# EasyEDA schematic TD-01 Mk3.json
TITLE: Sheet_1; REV: 1.0; Date: 2020-10-02; Sheet: 1/1; Company: Your Company
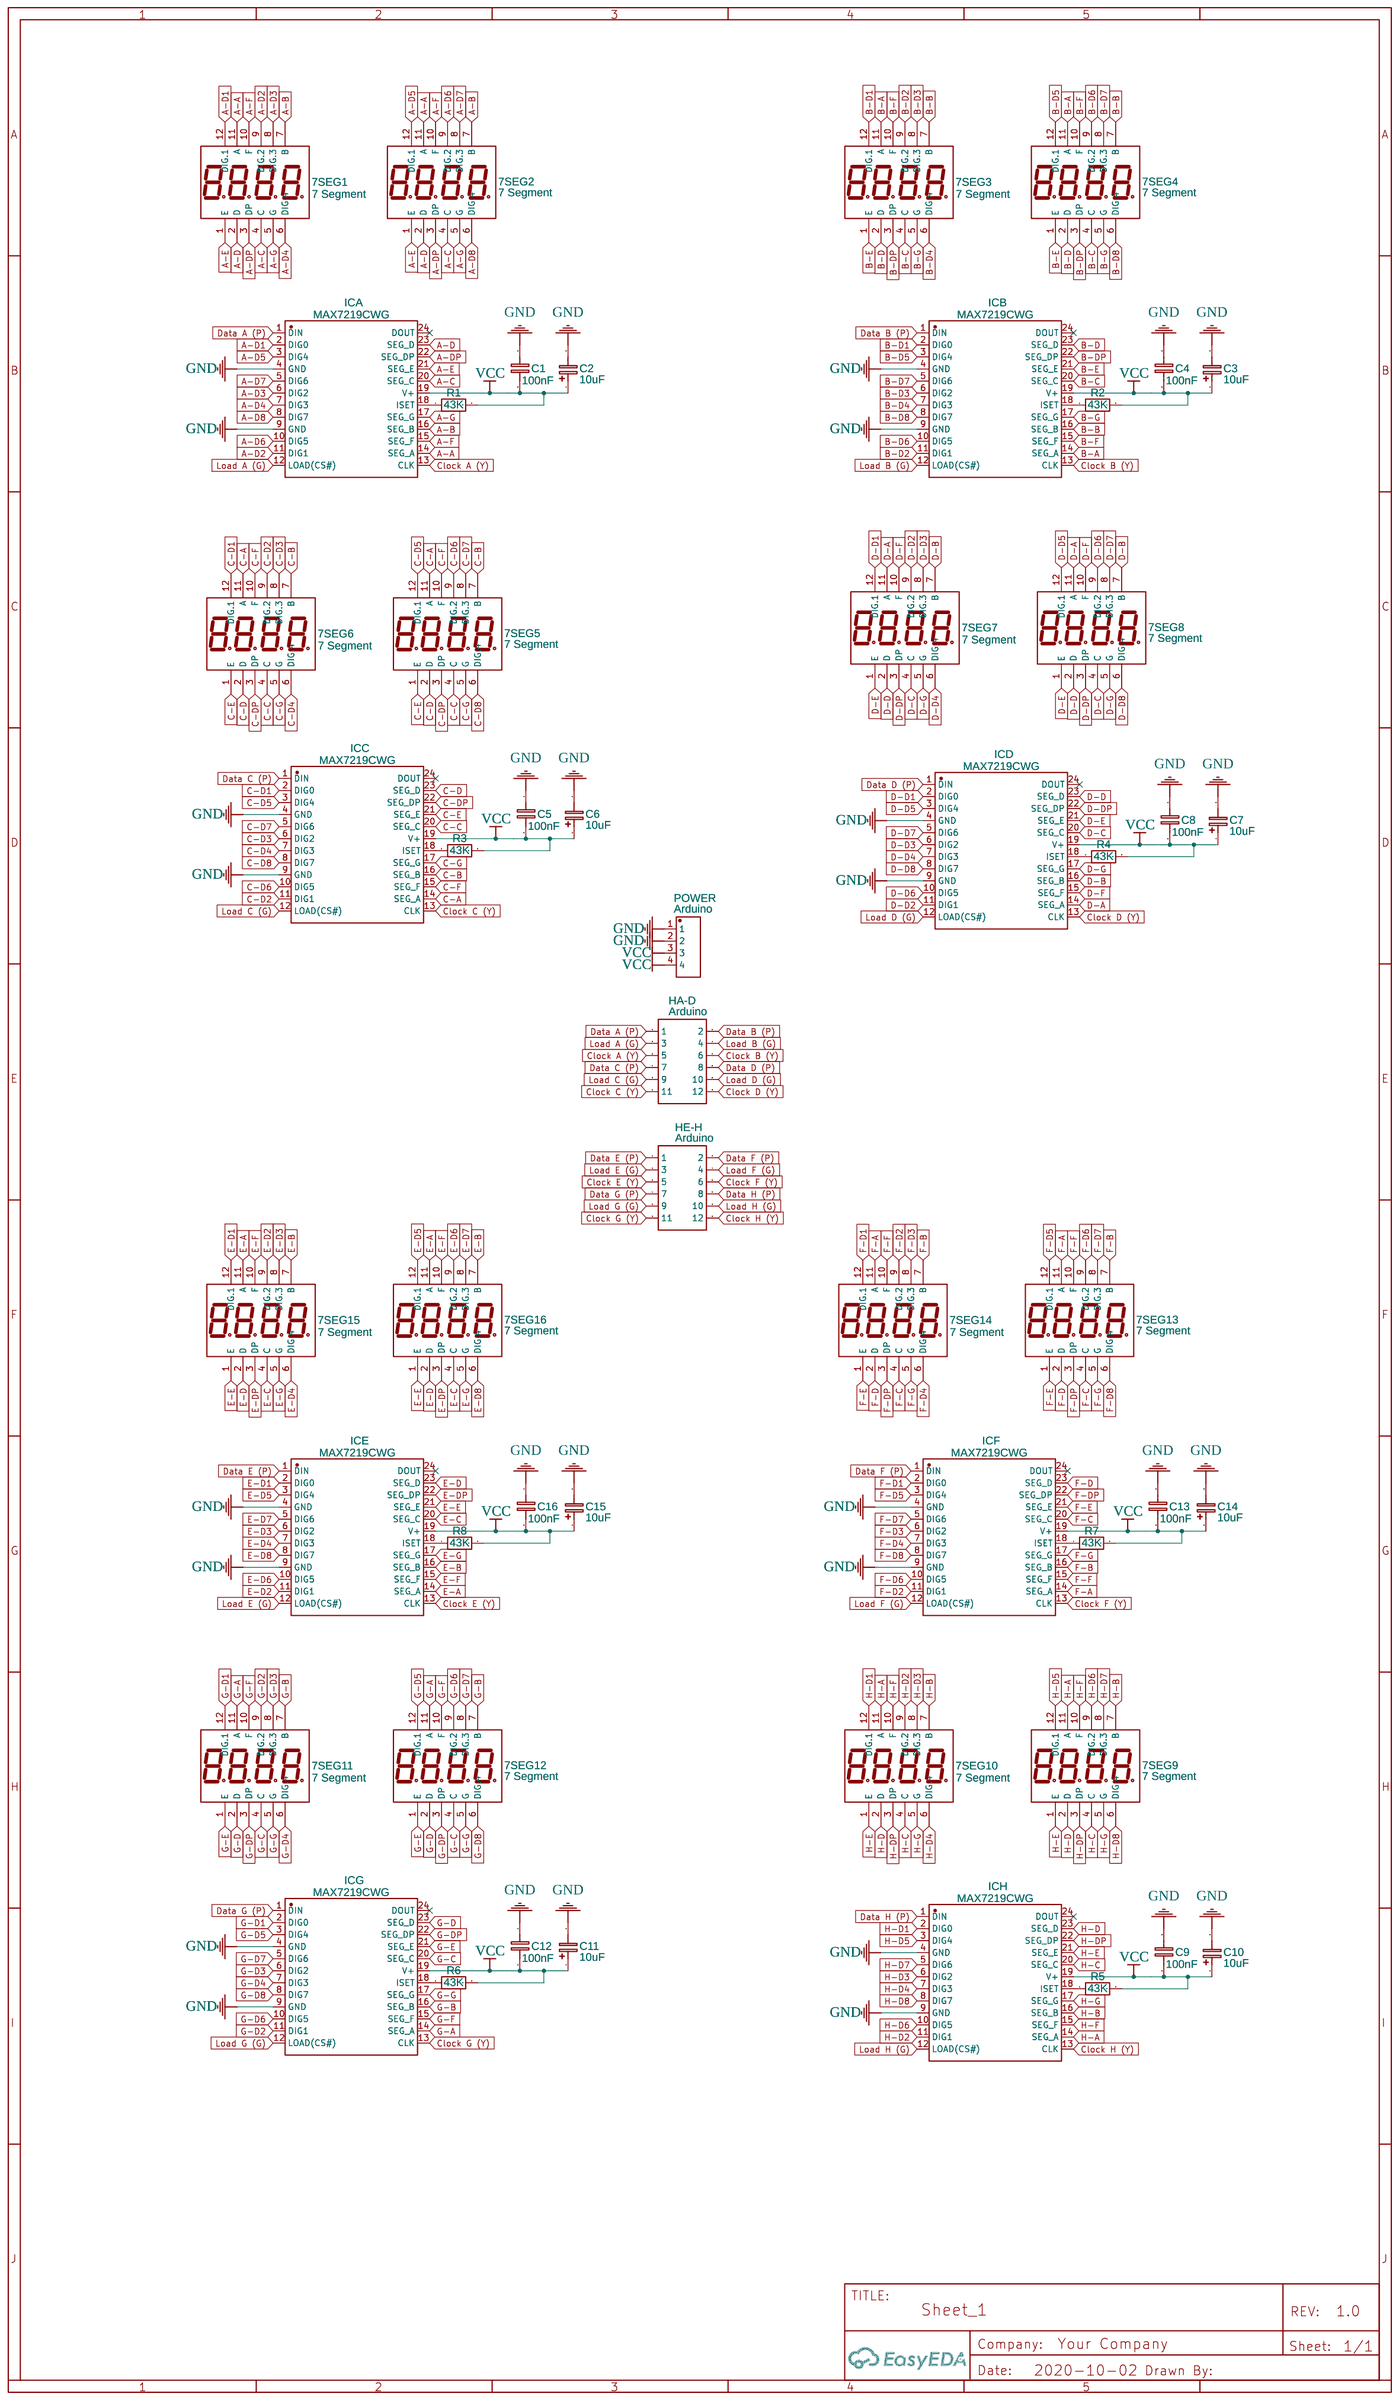
[diagram p0: schematic sheet]

## Parts
7SEG1  7 Segment  [LED-SEG-TH_12P-L50.3-W19.0-P2.54-S15.24-BL]
7SEG2  7 Segment  [LED-SEG-TH_12P-L50.3-W19.0-P2.54-S15.24-BL]
7SEG3  7 Segment  [LED-SEG-TH_12P-L50.3-W19.0-P2.54-S15.24-BL]
7SEG4  7 Segment  [LED-SEG-TH_12P-L50.3-W19.0-P2.54-S15.24-BL]
7SEG5  7 Segment  [LED-SEG-TH_12P-L50.3-W19.0-P2.54-S15.24-BL]
7SEG6  7 Segment  [LED-SEG-TH_12P-L50.3-W19.0-P2.54-S15.24-BL]
7SEG7  7 Segment  [LED-SEG-TH_12P-L50.3-W19.0-P2.54-S15.24-BL]
7SEG8  7 Segment  [LED-SEG-TH_12P-L50.3-W19.0-P2.54-S15.24-BL]
7SEG9  7 Segment  [LED-SEG-TH_12P-L50.3-W19.0-P2.54-S15.24-BL]
7SEG10  7 Segment  [LED-SEG-TH_12P-L50.3-W19.0-P2.54-S15.24-BL]
7SEG11  7 Segment  [LED-SEG-TH_12P-L50.3-W19.0-P2.54-S15.24-BL]
7SEG12  7 Segment  [LED-SEG-TH_12P-L50.3-W19.0-P2.54-S15.24-BL]
7SEG13  7 Segment  [LED-SEG-TH_12P-L50.3-W19.0-P2.54-S15.24-BL]
7SEG14  7 Segment  [LED-SEG-TH_12P-L50.3-W19.0-P2.54-S15.24-BL]
7SEG15  7 Segment  [LED-SEG-TH_12P-L50.3-W19.0-P2.54-S15.24-BL]
7SEG16  7 Segment  [LED-SEG-TH_12P-L50.3-W19.0-P2.54-S15.24-BL]
C1  100nF  [C0603]
C2  10uF  [CASE-A_3216]
C3  10uF  [CASE-A_3216]
C4  100nF  [C0603]
C5  100nF  [C0603]
C6  10uF  [CASE-A_3216]
C7  10uF  [CASE-A_3216]
C8  100nF  [C0603]
C9  100nF  [C0603]
C10  10uF  [CASE-A_3216]
C11  10uF  [CASE-A_3216]
C12  100nF  [C0603]
C13  100nF  [C0603]
C14  10uF  [CASE-A_3216]
C15  10uF  [CASE-A_3216]
C16  100nF  [C0603]
HA-D  Arduino  [HDR-TH_12P-P2.54-V-R2-C6-S2.54]
HE-H  Arduino  [HDR-TH_12P-P2.54-V-R2-C6-S2.54]
ICA  MAX7219CWG  [SOIC-24_L15.4-W7.5-P1.27-LS10.3-BL]
ICB  MAX7219CWG  [SOIC-24_L15.4-W7.5-P1.27-LS10.3-BL]
ICC  MAX7219CWG  [SOIC-24_L15.4-W7.5-P1.27-LS10.3-BL]
ICD  MAX7219CWG  [SOIC-24_L15.4-W7.5-P1.27-LS10.3-BL]
ICE  MAX7219CWG  [SOIC-24_L15.4-W7.5-P1.27-LS10.3-BL]
ICF  MAX7219CWG  [SOIC-24_L15.4-W7.5-P1.27-LS10.3-BL]
ICG  MAX7219CWG  [SOIC-24_L15.4-W7.5-P1.27-LS10.3-BL]
ICH  MAX7219CWG  [SOIC-24_L15.4-W7.5-P1.27-LS10.3-BL]
POWER  Arduino  [HDR-TH_4P-P2.54-V]
R1  43K  [R0603]
R2  43K  [R0603]
R3  43K  [R0603]
R4  43K  [R0603]
R5  43K  [R0603]
R6  43K  [R0603]
R7  43K  [R0603]
R8  43K  [R0603]

## Library data of the parts
7SEG1-7SEG16 = TOF-5461AMR-B17.5: Supplier: LCSC; Supplier Part: C417345; Manufacturer: OASIS; Contributor: LCSC
C1 C4 C5 C8 C9 C12 C13 C16 = C_0603_EU: Contributor: LCEDA_Lib
C2 C3 C6 C7 C10 C11 C14 C15 = C_Tan_SMD_A_EU: Contributor: LCEDA_Lib
HA-D HE-H = Header-Female-2.54_2x6: Supplier: LCSC; Manufacturer: BOOMELE; image: //image.lceda.cn/szlcsc/C36191.jpg; Supplier Part: C36191
ICA ICB ICC ICD ICE ICF ICG ICH = MAX7219CWG: Supplier: LCSC; Manufacturer: MAXIM; image: //image.lceda.cn/szlcsc/C9964.jpg; Supplier Part: C9964; LCSC Assembly: Yes; SMT Type: Extend
POWER = Header-Male-2.54_1x4_C59481: Supplier: LCSC; Manufacturer: ReliaPro; Manufacturer Part: Headers  Pins 1*4P; image: http://image.lceda.cn/szlcsc/C59481.jpg; Supplier Part: C59481
R1-R8 = R_0603_EU: Contributor: LCEDA_Lib

## Nets
GND: C1.1 C2.2 C3.2 C4.1 C5.1 C6.2 C7.2 C8.1 C9.1 C10.2 C11.2 C12.1 C13.1 C14.2 C15.2 C16.1 ICA.4(GND) ICA.9(GND) ICB.4(GND) ICB.9(GND) ICC.4(GND) ICC.9(GND) ICD.4(GND) ICD.9(GND) ICE.4(GND) ICE.9(GND) ICF.4(GND) ICF.9(GND) ICG.4(GND) ICG.9(GND) ICH.4(GND) ICH.9(GND) POWER.1 POWER.2
VCC: C1.2 C2.1 C3.1 C4.2 C5.2 C6.1 C7.1 C8.2 C9.2 C10.1 C11.1 C12.2 C13.2 C14.1 C15.1 C16.2 ICA.19(V+) ICB.19(V+) ICC.19(V+) ICD.19(V+) ICE.19(V+) ICF.19(V+) ICG.19(V+) ICH.19(V+) POWER.3 POWER.4 R1.2 R2.2 R3.2 R4.2 R5.2 R6.2 R7.2 R8.2
A-A: 7SEG1.11(A) 7SEG2.11(A) ICA.14(SEG A)
A-B: 7SEG1.7(B) 7SEG2.7(B) ICA.16(SEG B)
A-C: 7SEG1.4(C) 7SEG2.4(C) ICA.20(SEG C)
A-D: 7SEG1.2(D) 7SEG2.2(D) ICA.23(SEG D)
A-D1: 7SEG1.12(DIG.1) ICA.2(DIG0)
A-D2: 7SEG1.9(DIG.2) ICA.11(DIG1)
A-D3: 7SEG1.8(DIG.3) ICA.6(DIG2)
A-D4: 7SEG1.6(DIG.4) ICA.7(DIG3)
A-D5: 7SEG2.12(DIG.1) ICA.3(DIG4)
A-D6: 7SEG2.9(DIG.2) ICA.10(DIG5)
A-D7: 7SEG2.8(DIG.3) ICA.5(DIG6)
A-D8: 7SEG2.6(DIG.4) ICA.8(DIG7)
A-DP: 7SEG1.3(DP) 7SEG2.3(DP) ICA.22(SEG DP)
A-E: 7SEG1.1(E) 7SEG2.1(E) ICA.21(SEG E)
A-F: 7SEG1.10(F) 7SEG2.10(F) ICA.15(SEG F)
A-G: 7SEG1.5(G) 7SEG2.5(G) ICA.17(SEG G)
B-A: 7SEG3.11(A) 7SEG4.11(A) ICB.14(SEG A)
B-B: 7SEG3.7(B) 7SEG4.7(B) ICB.16(SEG B)
B-C: 7SEG3.4(C) 7SEG4.4(C) ICB.20(SEG C)
B-D: 7SEG3.2(D) 7SEG4.2(D) ICB.23(SEG D)
B-D1: 7SEG3.12(DIG.1) ICB.2(DIG0)
B-D2: 7SEG3.9(DIG.2) ICB.11(DIG1)
B-D3: 7SEG3.8(DIG.3) ICB.6(DIG2)
B-D4: 7SEG3.6(DIG.4) ICB.7(DIG3)
B-D5: 7SEG4.12(DIG.1) ICB.3(DIG4)
B-D6: 7SEG4.9(DIG.2) ICB.10(DIG5)
B-D7: 7SEG4.8(DIG.3) ICB.5(DIG6)
B-D8: 7SEG4.6(DIG.4) ICB.8(DIG7)
B-DP: 7SEG3.3(DP) 7SEG4.3(DP) ICB.22(SEG DP)
B-E: 7SEG3.1(E) 7SEG4.1(E) ICB.21(SEG E)
B-F: 7SEG3.10(F) 7SEG4.10(F) ICB.15(SEG F)
B-G: 7SEG3.5(G) 7SEG4.5(G) ICB.17(SEG G)
C-A: 7SEG5.11(A) 7SEG6.11(A) ICC.14(SEG A)
C-B: 7SEG5.7(B) 7SEG6.7(B) ICC.16(SEG B)
C-C: 7SEG5.4(C) 7SEG6.4(C) ICC.20(SEG C)
C-D: 7SEG5.2(D) 7SEG6.2(D) ICC.23(SEG D)
C-D1: 7SEG6.12(DIG.1) ICC.2(DIG0)
C-D2: 7SEG6.9(DIG.2) ICC.11(DIG1)
C-D3: 7SEG6.8(DIG.3) ICC.6(DIG2)
C-D4: 7SEG6.6(DIG.4) ICC.7(DIG3)
C-D5: 7SEG5.12(DIG.1) ICC.3(DIG4)
C-D6: 7SEG5.9(DIG.2) ICC.10(DIG5)
C-D7: 7SEG5.8(DIG.3) ICC.5(DIG6)
C-D8: 7SEG5.6(DIG.4) ICC.8(DIG7)
C-DP: 7SEG5.3(DP) 7SEG6.3(DP) ICC.22(SEG DP)
C-E: 7SEG5.1(E) 7SEG6.1(E) ICC.21(SEG E)
C-F: 7SEG5.10(F) 7SEG6.10(F) ICC.15(SEG F)
C-G: 7SEG5.5(G) 7SEG6.5(G) ICC.17(SEG G)
Clock A (Y): HA-D.5 ICA.13(CLK)
Clock B (Y): HA-D.6 ICB.13(CLK)
Clock C (Y): HA-D.11 ICC.13(CLK)
Clock D (Y): HA-D.12 ICD.13(CLK)
Clock E (Y): HE-H.5 ICE.13(CLK)
Clock F (Y): HE-H.6 ICF.13(CLK)
Clock G (Y): HE-H.11 ICG.13(CLK)
Clock H (Y): HE-H.12 ICH.13(CLK)
D-A: 7SEG7.11(A) 7SEG8.11(A) ICD.14(SEG A)
D-B: 7SEG7.7(B) 7SEG8.7(B) ICD.16(SEG B)
D-C: 7SEG7.4(C) 7SEG8.4(C) ICD.20(SEG C)
D-D: 7SEG7.2(D) 7SEG8.2(D) ICD.23(SEG D)
D-D1: 7SEG7.12(DIG.1) ICD.2(DIG0)
D-D2: 7SEG7.9(DIG.2) ICD.11(DIG1)
D-D3: 7SEG7.8(DIG.3) ICD.6(DIG2)
D-D4: 7SEG7.6(DIG.4) ICD.7(DIG3)
D-D5: 7SEG8.12(DIG.1) ICD.3(DIG4)
D-D6: 7SEG8.9(DIG.2) ICD.10(DIG5)
D-D7: 7SEG8.8(DIG.3) ICD.5(DIG6)
D-D8: 7SEG8.6(DIG.4) ICD.8(DIG7)
D-DP: 7SEG7.3(DP) 7SEG8.3(DP) ICD.22(SEG DP)
D-E: 7SEG7.1(E) 7SEG8.1(E) ICD.21(SEG E)
D-F: 7SEG7.10(F) 7SEG8.10(F) ICD.15(SEG F)
D-G: 7SEG7.5(G) 7SEG8.5(G) ICD.17(SEG G)
Data A (P): HA-D.1 ICA.1(DIN)
Data B (P): HA-D.2 ICB.1(DIN)
Data C (P): HA-D.7 ICC.1(DIN)
Data D (P): HA-D.8 ICD.1(DIN)
Data E (P): HE-H.1 ICE.1(DIN)
Data F (P): HE-H.2 ICF.1(DIN)
Data G (P): HE-H.7 ICG.1(DIN)
Data H (P): HE-H.8 ICH.1(DIN)
E-A: 7SEG15.11(A) 7SEG16.11(A) ICE.14(SEG A)
E-B: 7SEG15.7(B) 7SEG16.7(B) ICE.16(SEG B)
E-C: 7SEG15.4(C) 7SEG16.4(C) ICE.20(SEG C)
E-D: 7SEG15.2(D) 7SEG16.2(D) ICE.23(SEG D)
E-D1: 7SEG15.12(DIG.1) ICE.2(DIG0)
E-D2: 7SEG15.9(DIG.2) ICE.11(DIG1)
E-D3: 7SEG15.8(DIG.3) ICE.6(DIG2)
E-D4: 7SEG15.6(DIG.4) ICE.7(DIG3)
E-D5: 7SEG16.12(DIG.1) ICE.3(DIG4)
E-D6: 7SEG16.9(DIG.2) ICE.10(DIG5)
E-D7: 7SEG16.8(DIG.3) ICE.5(DIG6)
E-D8: 7SEG16.6(DIG.4) ICE.8(DIG7)
E-DP: 7SEG15.3(DP) 7SEG16.3(DP) ICE.22(SEG DP)
E-E: 7SEG15.1(E) 7SEG16.1(E) ICE.21(SEG E)
E-F: 7SEG15.10(F) 7SEG16.10(F) ICE.15(SEG F)
E-G: 7SEG15.5(G) 7SEG16.5(G) ICE.17(SEG G)
F-A: 7SEG13.11(A) 7SEG14.11(A) ICF.14(SEG A)
F-B: 7SEG13.7(B) 7SEG14.7(B) ICF.16(SEG B)
F-C: 7SEG13.4(C) 7SEG14.4(C) ICF.20(SEG C)
F-D: 7SEG13.2(D) 7SEG14.2(D) ICF.23(SEG D)
F-D1: 7SEG14.12(DIG.1) ICF.2(DIG0)
F-D2: 7SEG14.9(DIG.2) ICF.11(DIG1)
F-D3: 7SEG14.8(DIG.3) ICF.6(DIG2)
F-D4: 7SEG14.6(DIG.4) ICF.7(DIG3)
F-D5: 7SEG13.12(DIG.1) ICF.3(DIG4)
F-D6: 7SEG13.9(DIG.2) ICF.10(DIG5)
F-D7: 7SEG13.8(DIG.3) ICF.5(DIG6)
F-D8: 7SEG13.6(DIG.4) ICF.8(DIG7)
F-DP: 7SEG13.3(DP) 7SEG14.3(DP) ICF.22(SEG DP)
F-E: 7SEG13.1(E) 7SEG14.1(E) ICF.21(SEG E)
F-F: 7SEG13.10(F) 7SEG14.10(F) ICF.15(SEG F)
F-G: 7SEG13.5(G) 7SEG14.5(G) ICF.17(SEG G)
G-A: 7SEG11.11(A) 7SEG12.11(A) ICG.14(SEG A)
G-B: 7SEG11.7(B) 7SEG12.7(B) ICG.16(SEG B)
G-C: 7SEG11.4(C) 7SEG12.4(C) ICG.20(SEG C)
G-D: 7SEG11.2(D) 7SEG12.2(D) ICG.23(SEG D)
G-D1: 7SEG11.12(DIG.1) ICG.2(DIG0)
G-D2: 7SEG11.9(DIG.2) ICG.11(DIG1)
G-D3: 7SEG11.8(DIG.3) ICG.6(DIG2)
G-D4: 7SEG11.6(DIG.4) ICG.7(DIG3)
G-D5: 7SEG12.12(DIG.1) ICG.3(DIG4)
G-D6: 7SEG12.9(DIG.2) ICG.10(DIG5)
G-D7: 7SEG12.8(DIG.3) ICG.5(DIG6)
G-D8: 7SEG12.6(DIG.4) ICG.8(DIG7)
G-DP: 7SEG11.3(DP) 7SEG12.3(DP) ICG.22(SEG DP)
G-E: 7SEG11.1(E) 7SEG12.1(E) ICG.21(SEG E)
G-F: 7SEG11.10(F) 7SEG12.10(F) ICG.15(SEG F)
G-G: 7SEG11.5(G) 7SEG12.5(G) ICG.17(SEG G)
H-A: 7SEG9.11(A) 7SEG10.11(A) ICH.14(SEG A)
H-B: 7SEG9.7(B) 7SEG10.7(B) ICH.16(SEG B)
H-C: 7SEG9.4(C) 7SEG10.4(C) ICH.20(SEG C)
H-D: 7SEG9.2(D) 7SEG10.2(D) ICH.23(SEG D)
H-D1: 7SEG10.12(DIG.1) ICH.2(DIG0)
H-D2: 7SEG10.9(DIG.2) ICH.11(DIG1)
H-D3: 7SEG10.8(DIG.3) ICH.6(DIG2)
H-D4: 7SEG10.6(DIG.4) ICH.7(DIG3)
H-D5: 7SEG9.12(DIG.1) ICH.3(DIG4)
H-D6: 7SEG9.9(DIG.2) ICH.10(DIG5)
H-D7: 7SEG9.8(DIG.3) ICH.5(DIG6)
H-D8: 7SEG9.6(DIG.4) ICH.8(DIG7)
H-DP: 7SEG9.3(DP) 7SEG10.3(DP) ICH.22(SEG DP)
H-E: 7SEG9.1(E) 7SEG10.1(E) ICH.21(SEG E)
H-F: 7SEG9.10(F) 7SEG10.10(F) ICH.15(SEG F)
H-G: 7SEG9.5(G) 7SEG10.5(G) ICH.17(SEG G)
Load A (G): HA-D.3 ICA.12(LOAD(CS#))
Load B (G): HA-D.4 ICB.12(LOAD(CS#))
Load C (G): HA-D.9 ICC.12(LOAD(CS#))
Load D (G): HA-D.10 ICD.12(LOAD(CS#))
Load E (G): HE-H.3 ICE.12(LOAD(CS#))
Load F (G): HE-H.4 ICF.12(LOAD(CS#))
Load G (G): HE-H.9 ICG.12(LOAD(CS#))
Load H (G): HE-H.10 ICH.12(LOAD(CS#))
Net-(ICA-18): ICA.18(ISET) R1.1
Net-(ICB-18): ICB.18(ISET) R2.1
Net-(ICC-18): ICC.18(ISET) R3.1
Net-(ICD-18): ICD.18(ISET) R4.1
Net-(ICE-18): ICE.18(ISET) R8.1
Net-(ICF-18): ICF.18(ISET) R7.1
Net-(ICG-18): ICG.18(ISET) R6.1
Net-(ICH-18): ICH.18(ISET) R5.1

Not connected (* = marked no-connect by the designer): ICA 24(DOUT)*; ICB 24(DOUT)*; ICC 24(DOUT)*; ICD 24(DOUT)*; ICE 24(DOUT)*; ICF 24(DOUT)*; ICG 24(DOUT)*; ICH 24(DOUT)*
